# Altium schematic sheet subckt_3V3_SMPS.SchDoc: SMPS 3V3
size A3; DocumentNumber: 6; Revision: 0; SheetNumber: 6; SheetTotal: 19
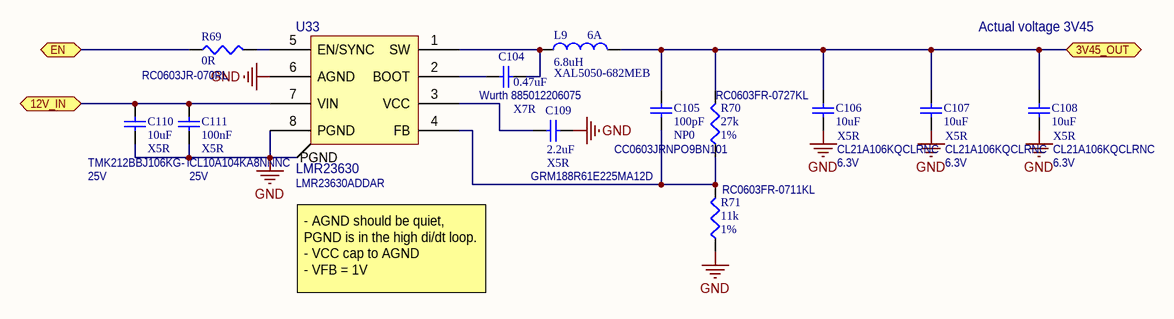
[diagram p0: subckt_3V3_SMPS.SchDoc]

## Parts
C104  value 0.47uF  Dielectric: X7R  Model: Wurth 885012206075  [CAP0603]
C105  value 100pF  Dielectric: NP0  Model: CC0603JRNPO9BN101  [CAP0603]
C106  value 10uF  Dielectric: X5R  Model: CL21A106KQCLRNC  Voltage: 6.3V  [CAP0805]  (hidden comment: Capacitor)
C107  value 10uF  Dielectric: X5R  Model: CL21A106KQCLRNC  Voltage: 6.3V  [CAP0805]  (hidden comment: Capacitor)
C108  value 10uF  Dielectric: X5R  Model: CL21A106KQCLRNC  Voltage: 6.3V  [CAP0805]  (hidden comment: Capacitor)
C109  value 2.2uF  Dielectric: X5R  Model: GRM188R61E225MA12D  [CAP0603]
C110  value 10uF  Dielectric: X5R  Model: TMK212BBJ106KG-T  Voltage: 25V  [CAP0805]  (hidden comment: Capacitor)
C111  value 100nF  Dielectric: X5R  Model: CL10A104KA8NNNC  Voltage: 25V  [CAP0603]  (hidden comment: Capacitor)
L9  6A  value 6.8uH  Model: XAL5050-682MEB  [IND XAL50]
R69  value 0R  Model: RC0603JR-070RL  [RES0603]  (hidden comment: Resistor)
R70  value 27k  Type: 1%  Model: RC0603FR-0727KL  [RES0603]  (hidden comment: Resistor)
R71  value 11k  Type: 1%  Model: RC0603FR-0711KL  [RES0603]  (hidden comment: Resistor)
U33  LMR23630  Model: LMR23630ADDAR  [SOIC8 Thermal Pad]

## Ports
3V45_OUT, 12V_IN, EN

## Nets
GND: C106.1 C107.1 C108.1 C109.2 C110.1 C111.1 R71.1 U33.6(AGND) U33.8(PGND) U33.9(PGND)
3V45_OUT: C105.2 C106.2 C107.2 C108.2 L9.2 R70.2 ; port 3V45_OUT
12V_IN: C110.2 C111.2 U33.7(VIN) ; port 12V_IN
EN: R69.1 ; port EN
NetC104_1: C104.1 L9.1 U33.1(SW)
NetC104_2: C104.2 U33.2(BOOT)
NetC105_1: C105.1 R70.1 R71.2 U33.4(FB)
NetC109_1: C109.1 U33.3(VCC)
NetR69_2: R69.2 U33.5(EN/SYNC)

## Notes on the sheet
- Actual voltage 3V45
- (near U33) - AGND should be quiet, PGND is in the high di/dt loop.
  - VCC cap to AGND
  - VFB = 1V

## Library data of the parts
C104 C105 C109 = Capacitor
L9 = Inductor
U33 = LMR23630: 3A Simple Switcher sync buck
R69-R71 = Resistor
  R69: Type: *